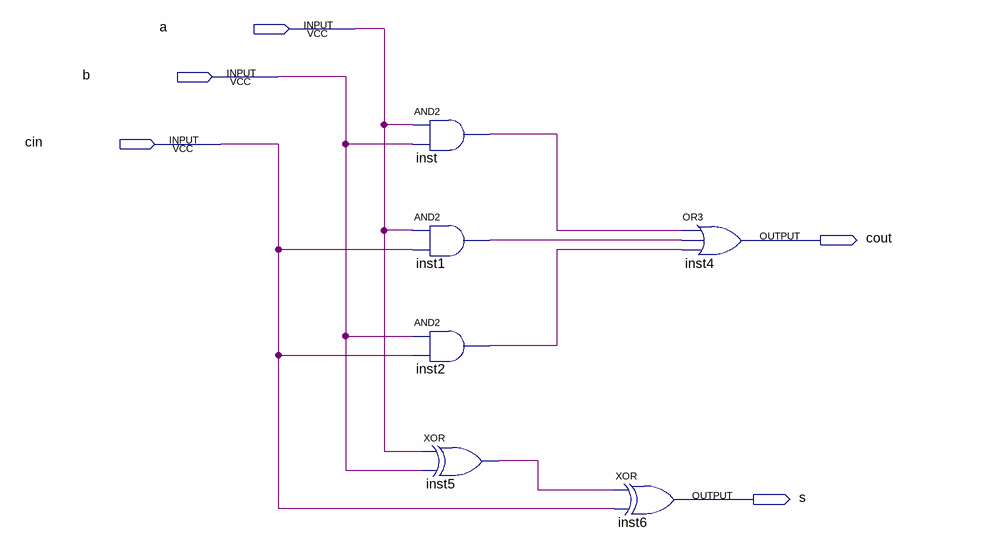
[diagram p0: schematic sheet]
// Quartus schematic FullAdder.bdf as structural Verilog: 6 symbols, 5 pins
module FullAdder (
  input  a,
  input  b,
  input  cin,
  output cout,
  output s
);

  wire inst1_out, inst2_out, inst5_out, inst_out;

  and inst (inst_out, a, b);
  and inst1 (inst1_out, a, cin);
  and inst2 (inst2_out, b, cin);
  xor inst5 (inst5_out, a, b);
  xor inst6 (s, inst5_out, cin);
  or inst4 (cout, inst_out, inst1_out, inst2_out);
endmodule
